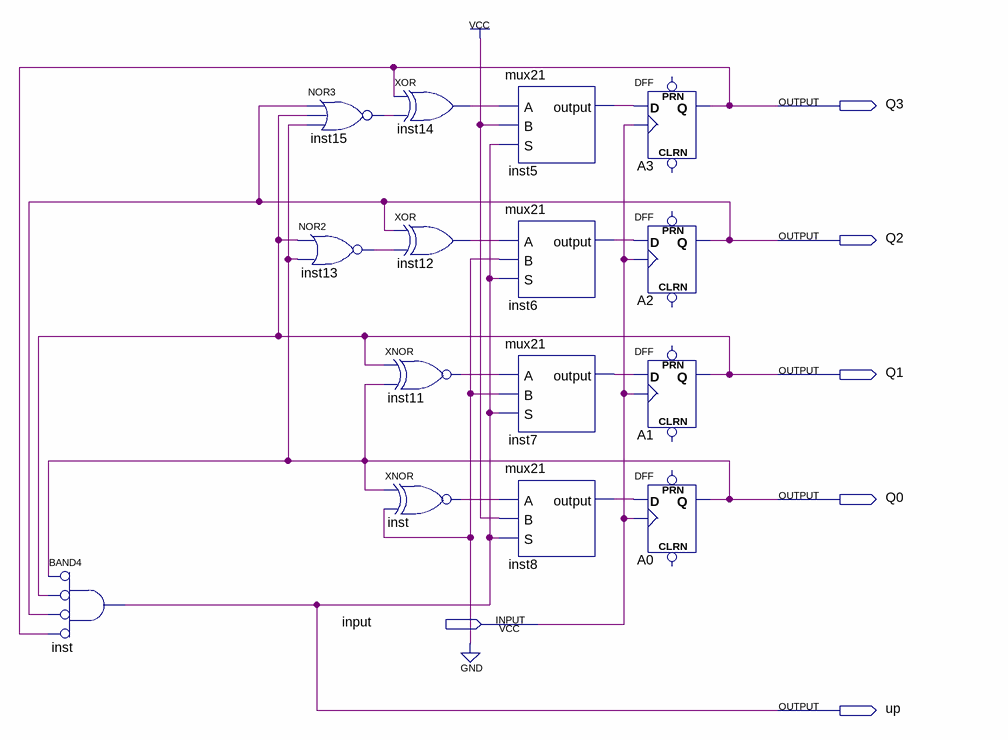
[diagram p0: schematic sheet]
// Quartus schematic bcd.bdf as structural Verilog: 15 symbols, 6 pins
module bcd (
  input  \input ,
  output Q3,
  output Q2,
  output Q1,
  output Q0,
  output up
);

  wire inst5_output, inst6_output, inst7_output, inst8_output, inst11_out, inst12_out, inst13_out,
       inst14_out, inst15_out, inst_out;

  and inst (up, ~Q0, ~Q1, ~Q2, ~Q3);  // BAND4
  nor inst15 (inst15_out, Q2, Q1, Q0);
  nor inst13 (inst13_out, Q1, Q0);
  xor inst14 (inst14_out, Q3, inst15_out);
  xor inst12 (inst12_out, Q2, inst13_out);
  xnor inst11 (inst11_out, Q1, Q0);
  xnor inst_dup2 (inst_out, Q0, 1'b0);
  mux21 inst5 (.A(inst14_out), .B(1'b1), .S(up), .\output (inst5_output));
  mux21 inst6 (.A(inst12_out), .B(1'b0), .S(up), .\output (inst6_output));
  mux21 inst7 (.A(inst11_out), .B(1'b0), .S(up), .\output (inst7_output));
  mux21 inst8 (.A(inst_out), .B(1'b1), .S(up), .\output (inst8_output));
  DFF A3 (.CLK(\input ), .D(inst5_output), .Q(Q3));  // open: CLRN, PRN
  DFF A2 (.CLK(\input ), .D(inst6_output), .Q(Q2));  // open: CLRN, PRN
  DFF A1 (.CLK(\input ), .D(inst7_output), .Q(Q1));  // open: CLRN, PRN
  DFF A0 (.CLK(\input ), .D(inst8_output), .Q(Q0));  // open: CLRN, PRN
endmodule
